# Altium schematic sheet PLmodule.SchDoc
size A4
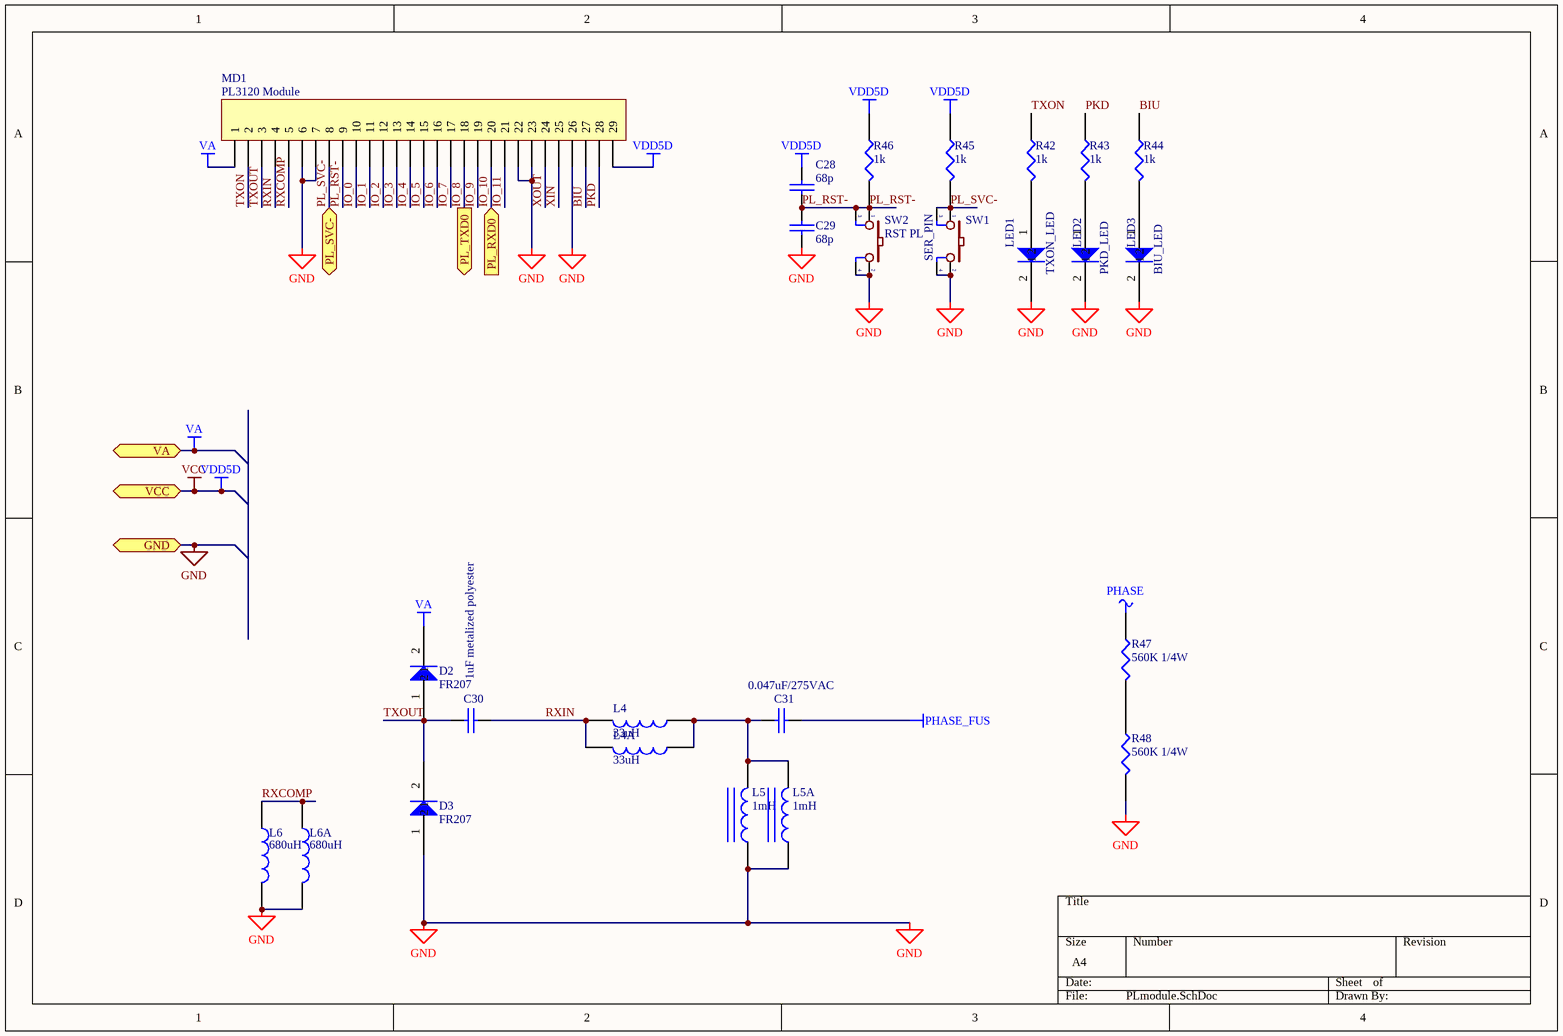
[diagram p0: PLmodule.SchDoc]

## Parts
C28  68p  [C6-0805_N]
C29  68p  [C6-0805_N]
C30  1uF metalized polyester  [CSIP3]
C31  0.047uF/275VAC  [100n400v]
D2  FR207  [DO-214AA]
D3  FR207  [DO-214AA]
L4  33uH  [6D28]
L4A  33uH  [Axial-0.4]
L5  1mH  [6-0805_N]
L5A  1mH  [AXIAL-0.4]
L6  680uH  [6-0805_N]
L6A  680uH  [AXIAL-0.4]
LED1  TXON_LED  [led3mm]
LED2  PKD_LED  [led3mm]
LED3  BIU_LED  [led3mm]
MD1  PL3120 Module  [ECHELONMODULE]
R42  1k  [6-0805_N]
R43  1k  [6-0805_N]
R44  1k  [6-0805_N]
R45  1k  [6-0805_N]
R46  1k  [6-0805_N]
R47  560K 1/4W  [R3216[1206]]
R48  560K 1/4W  [R3216[1206]]
SW1  SER_PIN  [SW-4P-S]
SW2  RST PL  [SW-4P-S]

## Ports
GND, PL_RXD0, PL_SVC-, PL_TXD0, VA, VCC

## Nets
GND: C29.2 D3.1 L5.2 L5A.2 L6.2 L6A.2 LED1.2 LED2.2 LED3.2 MD1.6 MD1.7 MD1.22 MD1.23 MD1.26 R48.1 SW1.2 SW1.4 SW2.2 SW2.4 ; port GND
PHASE: R47.2
PHASE_FUS: C31.1
VA: D2.2 MD1.1 ; port VA
VCC: C28.2 MD1.29 R45.1 R46.1 ; port VCC  [also labelled VDD5D]
BIU: MD1.27 R44.1
IO_0: MD1.10
IO_1: MD1.11
IO_2: MD1.12
IO_3: MD1.13
IO_4: MD1.14
IO_5: MD1.15
IO_6: MD1.16
IO_7: MD1.17
IO_8: MD1.18 ; port PL_TXD0
IO_9: MD1.19
IO_10: MD1.20 ; port PL_RXD0
IO_11: MD1.21
PKD: MD1.28 R43.1
PL_RST-: C28.1 C29.1 MD1.9 R46.2 SW2.1 SW2.3
PL_SVC-: MD1.8 R45.2 SW1.1 SW1.3 ; port PL_SVC-
RXCOMP: L6.1 L6A.1 MD1.5
RXIN: C30.2 L4.1 L4A.1 MD1.4
TXON: MD1.2 R42.1
TXOUT: C30.1 D2.1 D3.2 MD1.3
XIN: MD1.25
XOUT: MD1.24
NetC31_2: C31.2 L4.2 L4A.2 L5.1 L5A.1
NetLED1_1: LED1.1 R42.2
NetLED2_1: LED2.1 R43.2
NetLED3_1: LED3.1 R44.2
NetR47_1: R47.1 R48.2

## Library data of the parts
C28-C30 = CAP: Capacitor
C31 = CAP: X2 0.047uF/275VAC
D2 D3 = DIODE: pin to pad: 1>A 2>K
L4 = INDUCTOR: 0805 inductor
L4A = INDUCTOR: Axial inductor
L5 L5A = INDUCTOR IRON
L6 L6A = INDUCTOR
LED1-LED3 = DIODE
MD1 = CON29: Connector
R42-R48 = RES1
SW1 SW2 = SW4-1: Switch button 4 pin; pin to pad: 3>4 4>3; Value: SW chip 4 pin